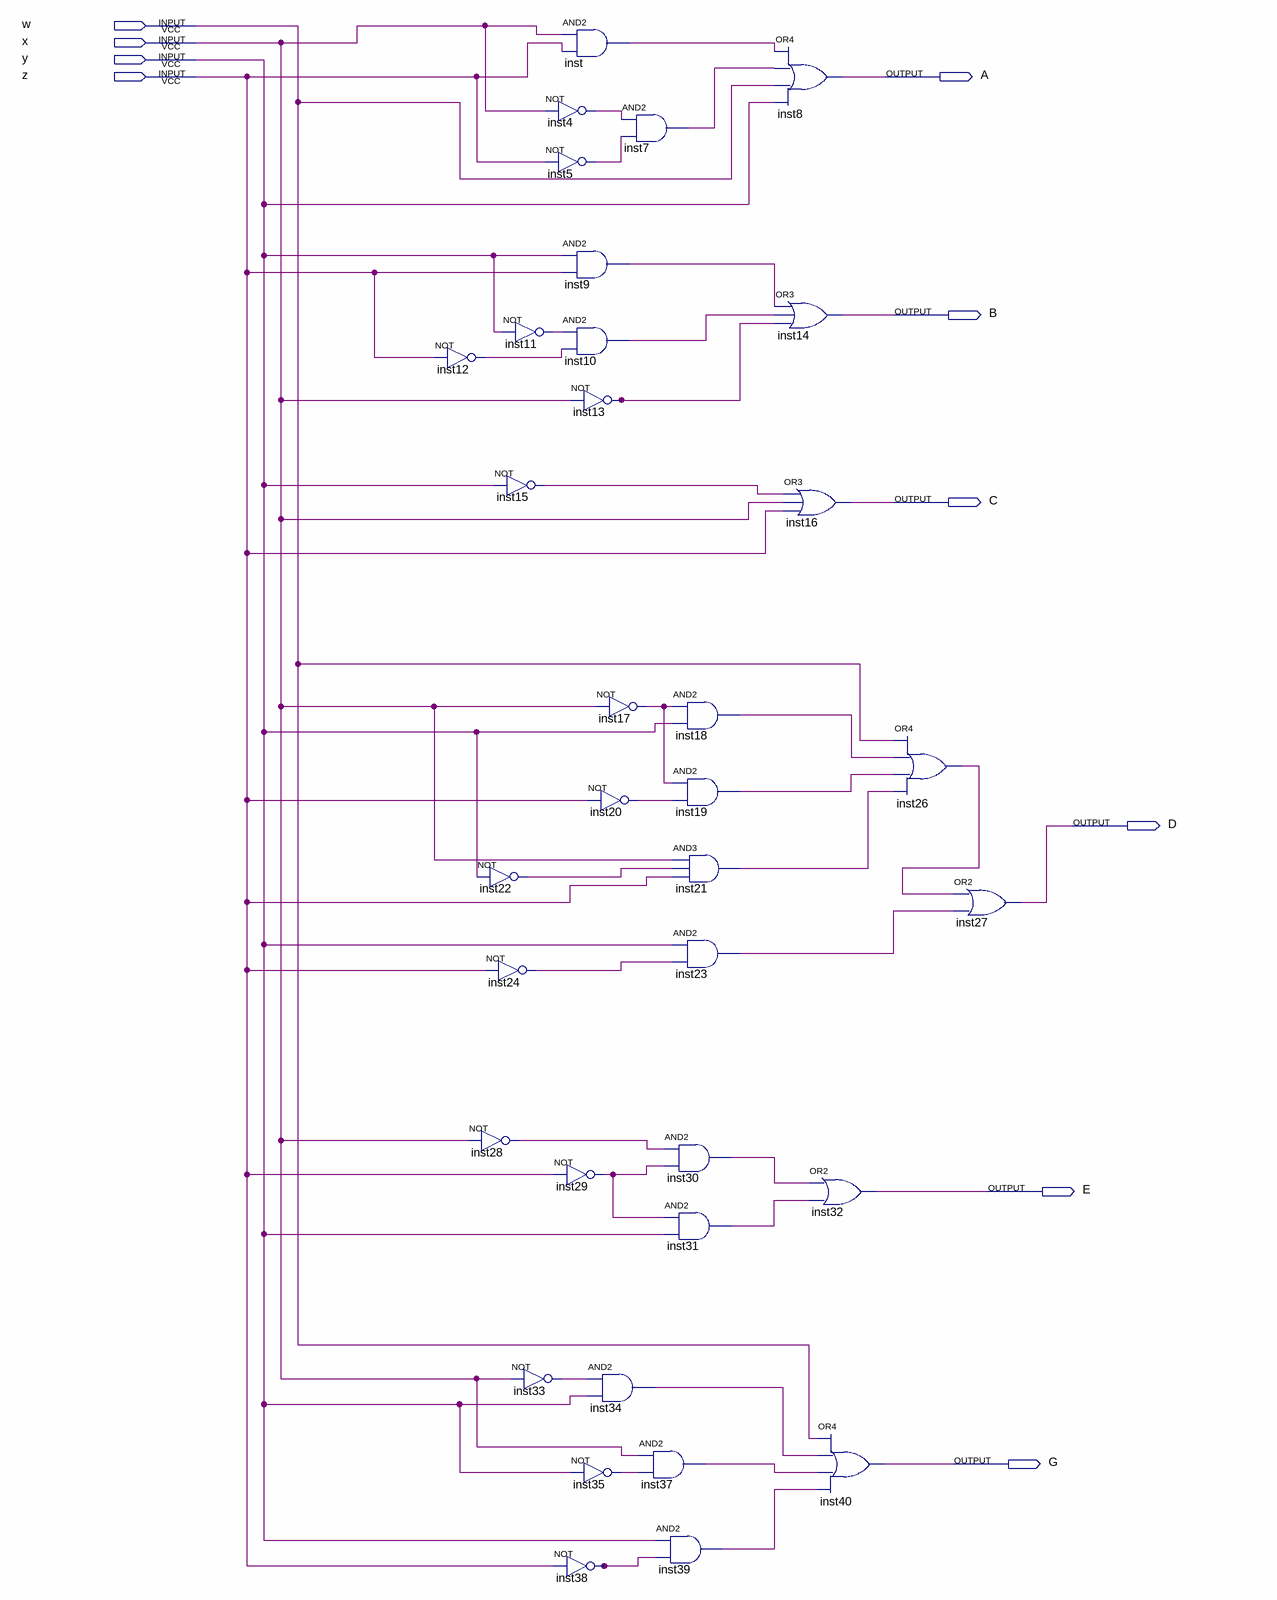
[diagram p0: schematic sheet]
// Quartus schematic 7segment.bdf as structural Verilog: 35 symbols, 10 pins
module \7segment  (
  input  w,
  input  x,
  input  y,
  input  z,
  output A,
  output B,
  output C,
  output D,
  output E,
  output G
);

  wire inst4_out, inst5_out, inst7_out, inst9_out, inst10_out, inst11_out, inst12_out, inst13_out,
       inst15_out, inst17_out, inst18_out, inst19_out, inst20_out, inst21_out, inst22_out, inst23_out,
       inst24_out, inst26_out, inst28_out, inst29_out, inst30_out, inst31_out, inst33_out, inst34_out,
       inst35_out, inst37_out, inst38_out, inst39_out, inst_out;

  not inst12 (inst12_out, z);
  not inst11 (inst11_out, y);
  not inst15 (inst15_out, y);
  not inst22 (inst22_out, y);
  not inst24 (inst24_out, z);
  not inst28 (inst28_out, x);
  and inst (inst_out, x, z);
  not inst4 (inst4_out, x);
  not inst5 (inst5_out, z);
  and inst9 (inst9_out, y, z);
  and inst10 (inst10_out, inst11_out, inst12_out);
  not inst13 (inst13_out, x);
  not inst29 (inst29_out, z);
  not inst33 (inst33_out, x);
  not inst35 (inst35_out, y);
  not inst38 (inst38_out, z);
  and inst7 (inst7_out, inst4_out, inst5_out);
  not inst17 (inst17_out, x);
  not inst20 (inst20_out, z);
  and inst34 (inst34_out, inst33_out, y);
  and inst37 (inst37_out, x, inst35_out);
  and inst18 (inst18_out, inst17_out, y);
  and inst19 (inst19_out, inst17_out, inst20_out);
  and inst21 (inst21_out, x, inst22_out, z);
  and inst23 (inst23_out, y, inst24_out);
  and inst30 (inst30_out, inst28_out, inst29_out);
  and inst31 (inst31_out, inst29_out, y);
  and inst39 (inst39_out, y, inst38_out);
  or inst8 (A, inst_out, inst7_out, w, y);
  or inst14 (B, inst9_out, inst10_out, inst13_out);
  or inst16 (C, inst15_out, x, z);
  or inst32 (E, inst30_out, inst31_out);
  or inst40 (G, w, inst34_out, inst37_out, inst39_out);
  or inst26 (inst26_out, w, inst18_out, inst19_out, inst21_out);
  or inst27 (D, inst26_out, inst23_out);
endmodule
